# Altium schematic sheet Sheet2(2).SchDoc
size A4
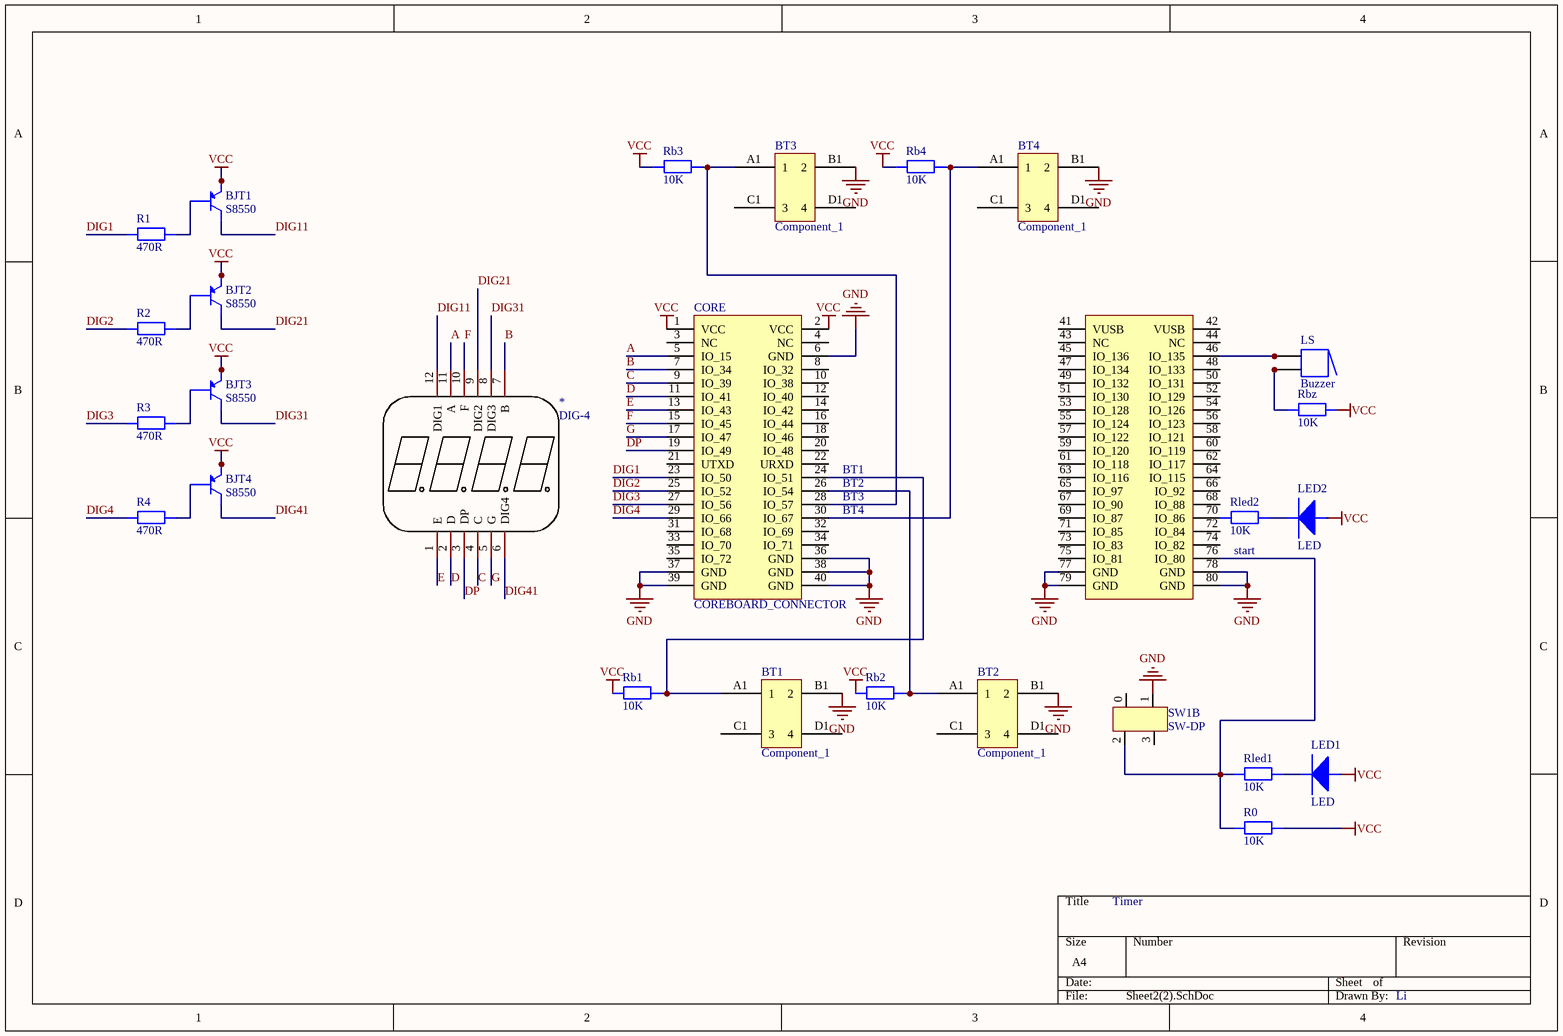
[diagram p0: Sheet2(2).SchDoc]

## Parts
*  DIG-4  [DIG-4]
BJT1  S8550  [TO-92]
BJT2  S8550  [TO-92]
BJT3  S8550  [TO-92]
BJT4  S8550  [TO-92]
BT1  Component_1  [TS665CJ]
BT2  Component_1  [TS665CJ]
BT3  Component_1  [TS665CJ]
BT4  Component_1  [TS665CJ]
CORE  COREBOARD_CONNECTOR  [coreboard_connector]
LED1  LED  [LED_TH_HLMP4700]
LED2  LED  [LED_TH_HLMP4700]
LS  Buzzer  [ABSM-1574]
R0  10K  [AXIAL-0.5]
R1  470R  [AXIAL-0.5]
R2  470R  [AXIAL-0.5]
R3  470R  [AXIAL-0.5]
R4  470R  [AXIAL-0.5]
Rb1  10K  [AXIAL-0.5]
Rb2  10K  [AXIAL-0.5]
Rb3  10K  [AXIAL-0.5]
Rb4  10K  [AXIAL-0.5]
Rbz  10K  [AXIAL-0.5]
Rled1  10K  [AXIAL-0.5]
Rled2  10K  [AXIAL-0.5]
SW1  SW-DP  [SW-DP_5P_W]  (part B of 2)

## Nets
GND: BT1.B1(2) BT2.B1(2) BT3.B1(2) BT4.B1(2) CORE.6(GND) CORE.36(GND) CORE.37(GND) CORE.38(GND) CORE.39(GND) CORE.40(GND) CORE.77(GND) CORE.78(GND) CORE.79(GND) CORE.80(GND) SW1.1
VCC: BJT1.1 BJT2.1 BJT3.1 BJT4.1 CORE.1(VCC) CORE.2(VCC) LED1.2 LED2.2 R0.2 Rb1.1 Rb2.1 Rb3.1 Rb4.1 Rbz.2
A: *.11(A) CORE.5(IO_15)
B: *.7(B) CORE.7(IO_34)
C: *.4(C) CORE.9(IO_39)
D: *.2(D) CORE.11(IO_41)
DIG1: CORE.23(IO_50) R1.1
DIG2: CORE.25(IO_52) R2.1
DIG3: CORE.27(IO_56) R3.1
DIG4: CORE.29(IO_66) R4.1
DIG11: *.12(DIG1) BJT1.3
DIG21: *.9(DIG2) BJT2.3
DIG31: *.8(DIG3) BJT3.3
DIG41: *.6(DIG4) BJT4.3
DP: *.3(DP) CORE.19(IO_49)
E: *.1(E) CORE.13(IO_43)
F: *.10(F) CORE.15(IO_45)
G: *.5(G) CORE.17(IO_47)
NetBJT1_2: BJT1.2 R1.2
NetBJT2_2: BJT2.2 R2.2
NetBJT3_2: BJT3.2 R3.2
NetBJT4_2: BJT4.2 R4.2
NetBT1_A1: BT1.A1(1) CORE.24(IO_51) Rb1.2
NetBT2_A1: BT2.A1(1) CORE.26(IO_54) Rb2.2
NetBT3_A1: BT3.A1(1) CORE.28(IO_57) Rb3.2
NetBT4_A1: BT4.A1(1) CORE.30(IO_67) Rb4.2
NetCORE_46: CORE.46(IO_135) LS.1 LS.1A
NetCORE_70: CORE.70(IO_86) Rled2.1
NetCORE_76: CORE.76(IO_80) R0.1 Rled1.1 SW1.2
NetLED1_1: LED1.1 Rled1.2
NetLED2_1: LED2.1 Rled2.2
NetLS_2: LS.2 LS.2A Rbz.1

Not connected (* = marked no-connect by the designer): BT1 C1(3) D1(4); BT2 C1(3) D1(4); BT3 C1(3) D1(4); BT4 C1(3) D1(4); CORE 3(NC) 4(NC) 8(IO_32) 10(IO_38) 12(IO_40) 14(IO_42) 16(IO_44) 18(IO_46) 20(IO_48) 21(UTXD) 22(URXD) 31(IO_68) 32(IO_69) 33(IO_70) 34(IO_71) 35(IO_72) 41(VUSB) 42(VUSB) 43(NC) 44(NC) 45(IO_136) 47(IO_134) 48(IO_133) 49(IO_132) 50(IO_131) 51(IO_130) 52(IO_129) 53(IO_128) 54(IO_126) 55(IO_124) 56(IO_123) 57(IO_122) 58(IO_121) 59(IO_120) 60(IO_119) 61(IO_118) 62(IO_117) 63(IO_116) 64(IO_115) 65(IO_97) 66(IO_92) 67(IO_90) 68(IO_88) 69(IO_87) 71(IO_85) 72(IO_84) 73(IO_83) 74(IO_82) 75(IO_81); SW1 0 3

## Notes on the sheet
- (near CORE) BT1
- (near CORE) BT2
- (near CORE) BT3
- (near CORE) BT4
- start
- Timer
- Li

## Library data of the parts
LS = Buzzer: Magnetic Transducer Buzzer; Published: 24-Mar-1999; LatestRevisionDate: 17-Dec-2003; LatestRevisionNote: Schematic revised, PCB Footprint replaced.; DatasheetVersion: 17-Dec-2003; PackageReference: ABSM-1574; Publisher: Altium Limited; PackageDescription: Magnetic Transducer Buzzer; ComponentLink1Description: Manufacturer Link; ComponentLink1URL: http://www.megastar.com/linecard/buzzmode/index.php
R0-R4 Rb1-Rb4 Rbz Rled1 Rled2 = AXIAL